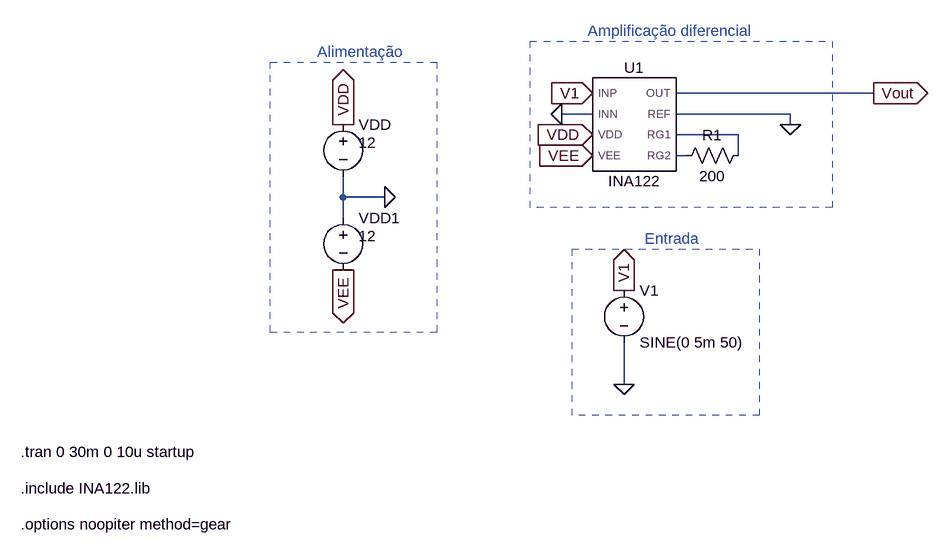
[diagram p0: schematic Circuito.asc]
Circuito.asc, the LTspice schematic file:
Version 4.1
SHEET 1 880 776
WIRE 544 96 240 96
WIRE 112 128 64 128
WIRE 416 128 240 128
WIRE 416 144 416 128
WIRE 336 160 240 160
WIRE 256 192 240 192
WIRE 336 192 336 160
WIRE -272 256 -272 224
WIRE -208 256 -272 256
WIRE -272 288 -272 256
WIRE 160 544 160 480
FLAG 160 544 0
FLAG 112 96 V1
IOPIN 112 96 In
FLAG -208 256 0
FLAG 112 160 VDD
IOPIN 112 160 In
FLAG 112 192 VEE
IOPIN 112 192 In
FLAG -272 144 VDD
IOPIN -272 144 Out
FLAG 160 400 V1
IOPIN 160 400 Out
FLAG -272 368 VEE
IOPIN -272 368 Out
FLAG 544 96 Vout
IOPIN 544 96 Out
FLAG 64 128 0
FLAG 416 144 0
SYMBOL INA122 176 144 R0
SYMATTR InstName U1
SYMBOL voltage 160 384 R0
WINDOW 123 0 0 Left 0
WINDOW 39 0 0 Left 0
SYMATTR InstName V1
SYMATTR Value SINE(0 5m 50)
SYMBOL voltage -272 128 R0
WINDOW 3 24 44 Left 2
WINDOW 123 0 0 Left 0
WINDOW 39 0 0 Left 0
SYMATTR Value 12
SYMATTR InstName VDD
SYMBOL res 352 176 R90
WINDOW 0 0 56 VBottom 2
WINDOW 3 32 56 VTop 2
SYMATTR InstName R1
SYMATTR Value 200
SYMBOL voltage -272 272 R0
WINDOW 3 24 44 Left 2
WINDOW 123 0 0 Left 0
WINDOW 39 0 0 Left 0
SYMATTR Value 12
SYMATTR InstName VDD1
TEXT -768 648 Left 2 !.tran 0 30m 0 10u startup
TEXT -768 704 Left 2 !.include INA122.lib
TEXT -768 760 Left 2 !.options noopiter method=gear
TEXT -312 32 Left 2 ;Alimentação
TEXT 192 320 Left 2 ;Entrada
TEXT 104 0 Left 2 ;Amplificação diferencial
RECTANGLE Normal -128 464 -384 48 2
RECTANGLE Normal 480 272 16 16 2
RECTANGLE Normal 368 592 80 336 2

The netlist it stands for:
* Circuito.asc
X§U1 V1 0 VDD VEE Vout 0 N001 N002 INA122  ; pins INP INN VDD VEE OUT REF RG1 RG2
V1 V1 0 SINE(0 5m 50)
VDD VDD 0 12
R1 N001 N002 200
VDD1 0 VEE 12
.tran 0 30m 0 10u startup
.include INA122.lib
.options noopiter method=gear
* Alimentação
* Entrada
* Amplificação diferencial
.backanno
.end